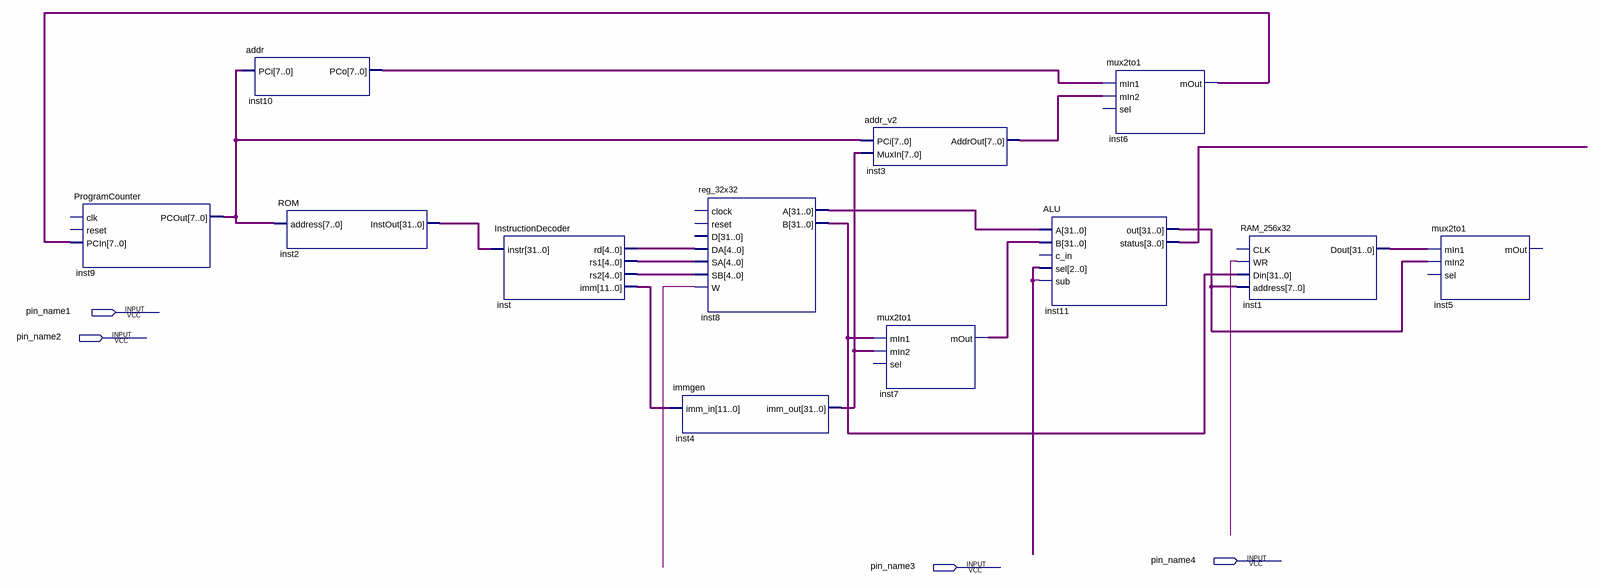
[diagram p0: schematic sheet]
// Quartus schematic Inside Block Diagram.bdf as structural Verilog: 12 symbols, 4 pins
module \Inside_Block_Diagram  (
  input  pin_name1,
  input  pin_name2,
  input  pin_name4,
  input  pin_name3
);

  wire undriven, undriven_3, undriven_4;
  wire [2:0] undriven_2;
  wire [3:0] inst11_status;
  wire [4:0] inst_rd, inst_rs1, inst_rs2;
  wire [7:0] inst3_addrout, inst6_mout, inst9_pcout, inst10_pco;
  wire [11:0] inst_imm;
  wire [31:0] inst1_dout, inst2_instout, inst4_imm_out, inst7_mout, inst8_a, inst8_b, inst11_out;

  ProgramCounter inst9 (.PCIn(inst6_mout), .PCOut(inst9_pcout));  // open: clk, reset
  addr inst10 (.PCi(inst9_pcout), .PCo(inst10_pco));
  ROM inst2 (.address(inst9_pcout), .InstOut(inst2_instout));
  InstructionDecoder inst (.instr(inst2_instout), .rd(inst_rd), .rs1(inst_rs1), .rs2(inst_rs2), .imm(inst_imm));
  reg_32x32 inst8 (
    .DA(inst_rd), .SA(inst_rs1), .SB(inst_rs2), .W(undriven_4), .A(inst8_a), .B(inst8_b));  // open: clock, reset, D
  immgen inst4 (.imm_in(inst_imm), .imm_out(inst4_imm_out));
  addr_v2 inst3 (.PCi(inst9_pcout), .MuxIn(inst4_imm_out), .AddrOut(inst3_addrout));
  mux2to1 inst7 (.mIn1(inst8_b), .mIn2(inst4_imm_out), .mOut(inst7_mout));  // open: sel
  ALU inst11 (
    .A(inst8_a), .B(inst7_mout), .sel(undriven_2), .sub(undriven_3), .out(inst11_out), .status(inst11_status));  // open: c_in
  mux2to1 inst6 (.mIn1(inst10_pco), .mIn2(inst3_addrout), .mOut(inst6_mout));  // open: sel
  RAM_256x32 inst1 (.WR(undriven), .Din(inst8_b), .address(inst11_out), .Dout(inst1_dout));  // open: CLK
  mux2to1 inst5 (.mIn1(inst1_dout), .mIn2(inst11_out));  // open: sel, mOut
endmodule
